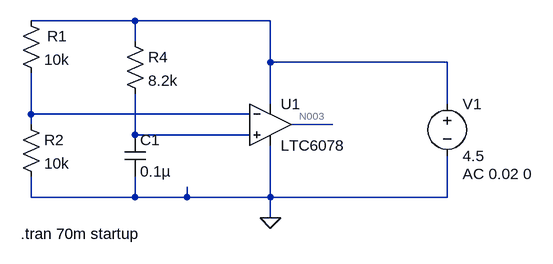
[diagram p0: schematic init_pulse.asc]
init_pulse.asc, the LTspice schematic file:
Version 4.1
SHEET 1 880 680
WIRE -16 16 -176 16
WIRE 192 16 -16 16
WIRE -16 48 -16 16
WIRE 192 80 192 16
WIRE 464 80 192 80
WIRE 192 144 192 80
WIRE 464 144 464 80
WIRE -176 160 -176 96
WIRE 160 160 -176 160
WIRE -176 176 -176 160
WIRE 288 176 224 176
WIRE -16 192 -16 128
WIRE 160 192 -16 192
WIRE -176 288 -176 256
WIRE -16 288 -16 256
WIRE -16 288 -176 288
WIRE 64 288 64 272
WIRE 64 288 -16 288
WIRE 192 288 192 208
WIRE 192 288 64 288
WIRE 464 288 464 224
WIRE 464 288 192 288
WIRE 192 320 192 288
FLAG 192 320 0
SYMBOL OpAmps\\LTC6078 192 176 R0
SYMATTR InstName U1
SYMBOL voltage 464 128 R0
WINDOW 123 24 124 Left 2
WINDOW 39 24 124 Left 2
SYMATTR Value2 AC 0.02 0
SYMATTR InstName V1
SYMATTR Value 4.5
SYMBOL res -192 0 R0
WINDOW 0 41 40 Left 2
SYMATTR InstName R1
SYMATTR Value 10k
SYMATTR SpiceLine tol=10
SYMBOL res -192 160 R0
SYMATTR InstName R2
SYMATTR Value 10k
SYMATTR SpiceLine tol=10
SYMBOL cap -32 192 R0
SYMATTR InstName C1
SYMATTR Value 0.1µ
SYMATTR SpiceLine V=10 Irms=0 Rser=0.0268 Lser=311p mfg="Würth Elektronik" pn="885012105010 WCAP-CSGP 0402" type="X5R"
SYMBOL res -32 32 R0
SYMATTR InstName R4
SYMATTR Value 8.2k
SYMATTR SpiceLine tol=10
TEXT -192 344 Left 2 !.tran 70m startup

The netlist it stands for:
* init_pulse.asc
X§U1 N004 N002 N001 0 N003 LTC6078  ; pins IN+ IN- VCC VEE OUT
V1 N001 0 4.5 AC 0.02 0
R1 N001 N002 10k tol=10
R2 N002 0 10k tol=10
C1 N004 0 0.1µ V=10 Irms=0 Rser=0.0268 Lser=311p mfg="Würth Elektronik" pn="885012105010 WCAP-CSGP 0402" type="X5R"
R4 N001 N004 8.2k tol=10
.tran 70m startup
.lib LTC5.lib
.backanno
.end

* Results of the author's LTspice run, read from the files saved beside the schematic
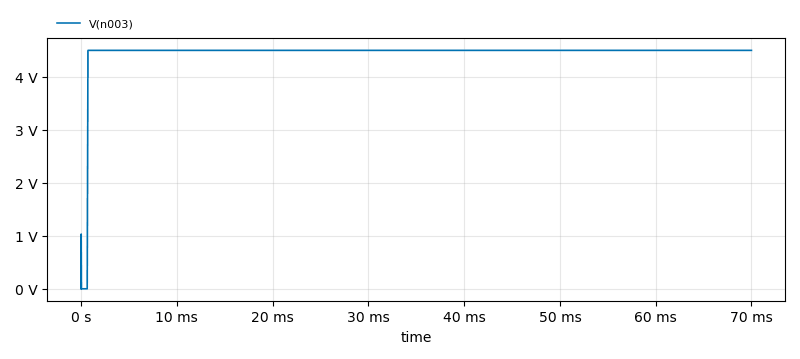
[diagram p1: Transient Analysis of init_pulse.asc, plotted from the saved traces]
* Transient Analysis, 1 run:
*   V(n003): min 0 V, max 4.5 V, average 4.456 V, rms 4.478 V, last 4.5 V